# EAGLE schematic PolIrkutska_DOZATOR_el (EAGLE 7.0.0)
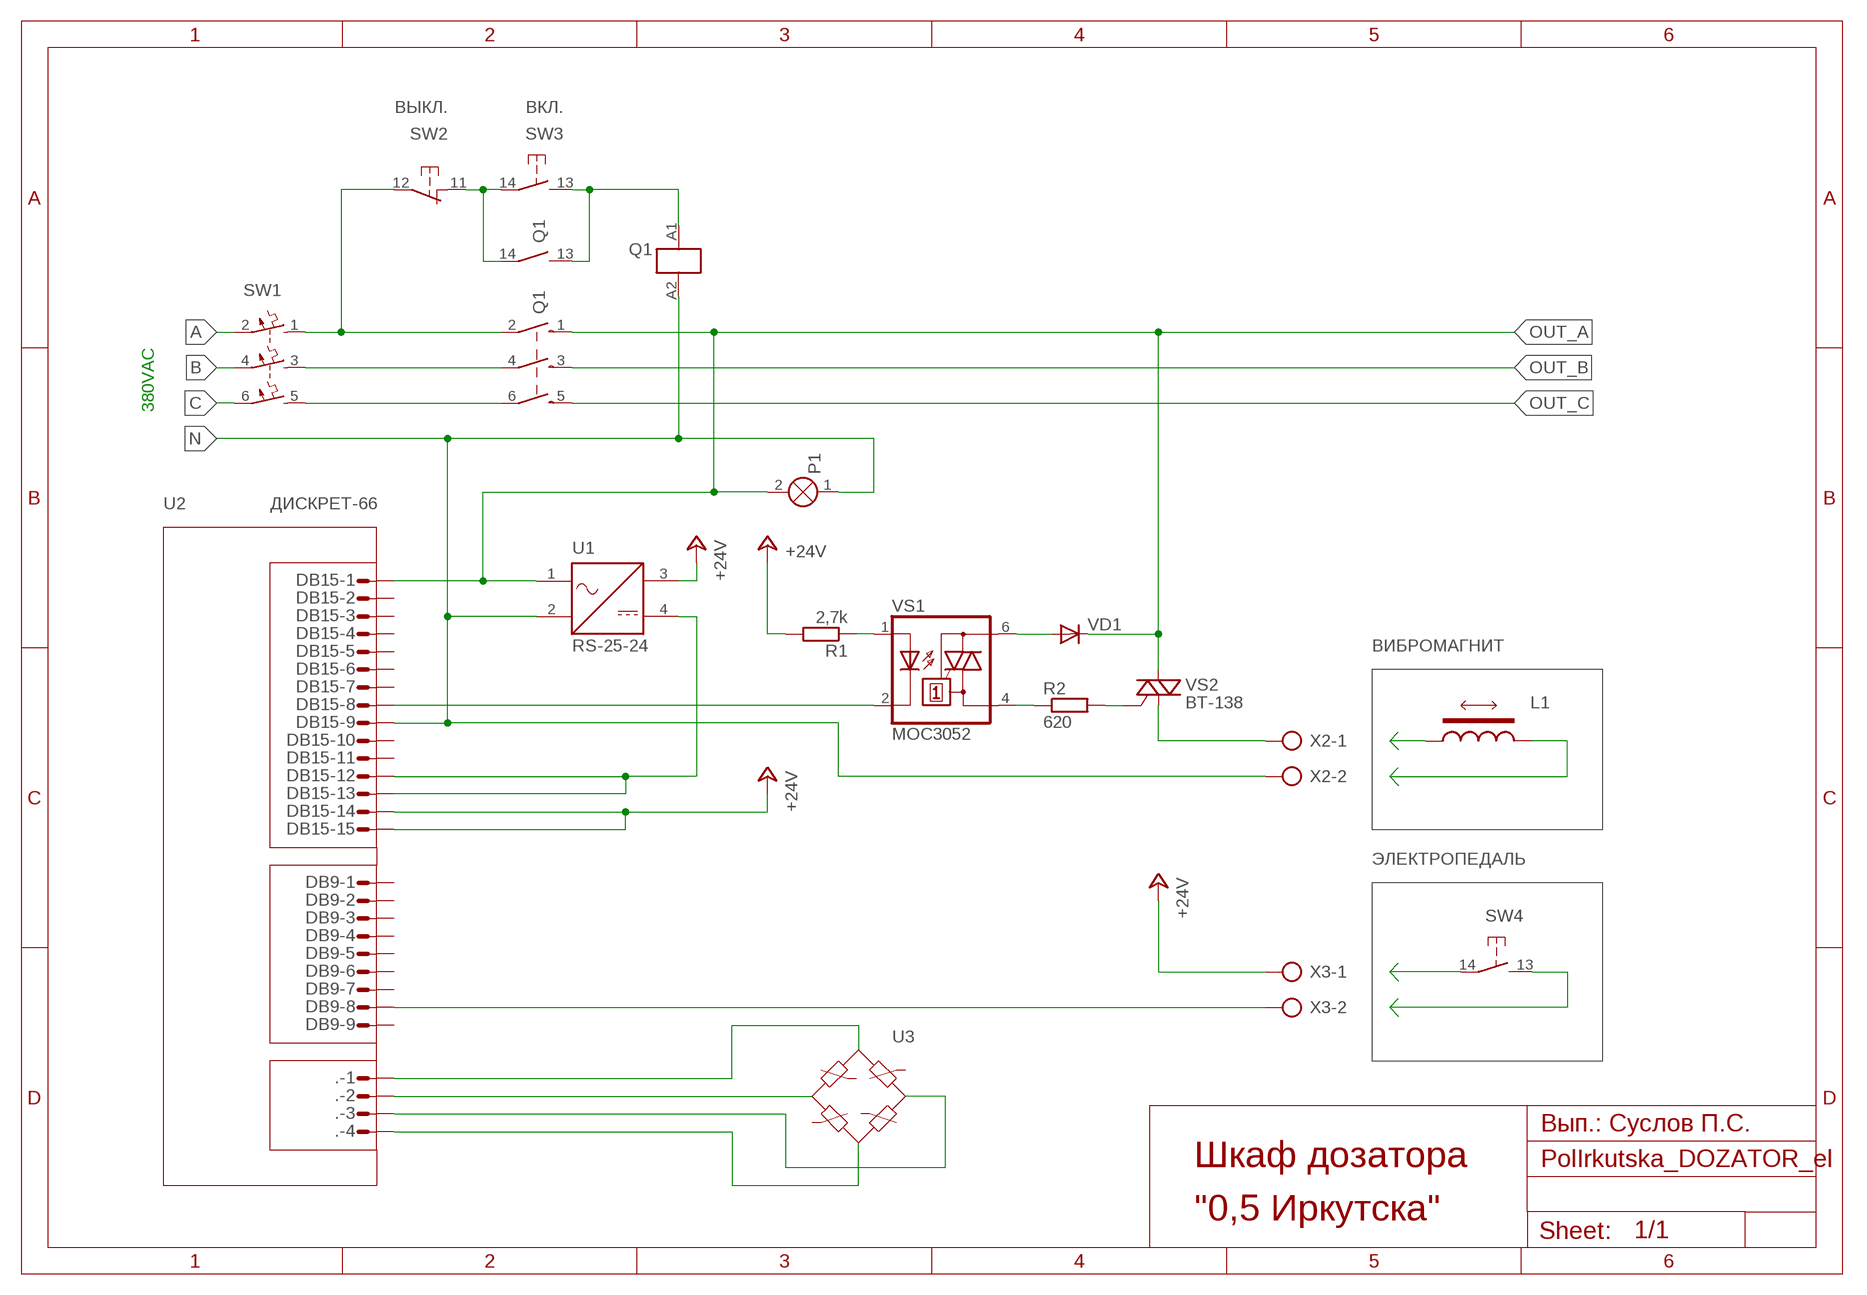
[diagram p0: schematic, sheet 1]

## Parts
.  L04P  [L04P]
DB9  L09P  [L09P]
DB15  L15P  [L15P]
L1  L-US0204/5  [0204/5]
P1  SIGNALLAMPE  [LAMPE]
Q1  HAUPTSCHUETZ_3-POL_HILFSKONTAKT_13-14  [HAUPTSCHUETZ_3-POL+HILFSKONTAKT_13-14]
R1  2,7k  R-EU_0204/2V  [0204V]
R2  620  R-EU_0204/2V  [0204V]
SW1  LEITUNGSSCHUTZSCHALTER_3-POL  [LEITUNGSSCHUTZSCHALTER_3-POL]
SW2  ВЫКЛ.  OEFFNER_TASTSCHALTER  [OEFFNER_TASTSCHALTER]
SW3  ВКЛ.  SCHLIESSER_TASTSCHALTER  [SCHLIESSER_TASTSCHALTER]
SW4  SCHLIESSER_TASTSCHALTER  [SCHLIESSER_TASTSCHALTER]
U1  RS-25-24  NETZTEIL_GLEICHSPANNUNG  [NETZTEIL_GLEICHSPANNUNG]
VD1  1N4148DO35-7  [DO35-7]
VS1  MOC3052  MOC3042T  [DIL06B]
VS2  BT-138  TRIAC  [TRIAC]
X2  AK500/2  [AK500/2]
X3  AK500/2  [AK500/2]

## Nets
+24V: DB15.14 DB15.15 R1.2 U1.3 X3.1
A: SW1.2
B: SW1.4
C: SW1.6
N: DB15.9 P1.1(X1) Q1.A2(1:A2) U1.2 X2.2
N$2: VS2.A2 X2.1
N$3: R2.1 VS1.4(A1)
N$4: Q1.6 SW1.5
N$5: Q1.13 Q1.A1(1:A1) SW3.13
N$6: Q1.14 SW2.11 SW3.14
N$7: Q1.4 SW1.3
N$8: R2.2 VS2.G
N$9: VD1.A VS1.6(A2)
N$10: Q1.2 SW1.1 SW2.12
N$11: R1.1 VS1.1(A)
N$12: DB15.8 VS1.2(C)
N$13: DB9.8 X3.2
N$15: DB15.12 DB15.13 U1.4
N$16: ..1
N$17: ..2
N$18: ..3
N$19: ..4
N$20: L1.1
N$21: L1.2
N$22: SW4.14
N$23: SW4.13
OUT_A: DB15.1 P1.2(X2) Q1.1 U1.1 VD1.C VS2.A1
OUT_B: Q1.3
OUT_C: Q1.5
Unconnected: DB9.1 DB9.2 DB9.3 DB9.4 DB9.5 DB9.6 DB9.7 DB9.9 DB15.2 DB15.3 DB15.4 DB15.5 DB15.6 DB15.7 DB15.10 DB15.11

## Notes on the sheet
- 380VAC
- U2 | ДИСКРЕТ-66
- ВИБРОМАГНИТ
- ЭЛЕКТРОПЕДАЛЬ
- U3
- Вып.: Суслов П.С.
- Шкаф дозатора
- "0,5 Иркутска"

## Library data of the parts
. = con-amp-mt:L04P: AMP MT CONNECTOR; OC_FARNELL: unknown; OC_NEWARK: unknown
DB9 = con-amp-mt:L09P: AMP MT CONNECTOR; OC_FARNELL: unknown; OC_NEWARK: unknown
DB15 = con-amp-mt:L15P: AMP MT CONNECTOR; OC_FARNELL: unknown; OC_NEWARK: unknown
L1 = rcl:L-US: INDUCTOR, American symbol
P1 = e-lampen-signalisation:SIGNALLAMPE: Lampe
Q1 = e-schuetze-relais:HAUPTSCHUETZ_3-POL_HILFSKONTAKT_13-14: Hauptschütz 3-pol. mit Hilfskontakt-Schließer
R1 R2 = rcl:R-EU_: RESISTOR, European symbol
SW1 = e-sicherungen:LEITUNGSSCHUTZSCHALTER_3-POL: Leitungsschutzschalter, 3-pol.
SW2 = e-schalter:OEFFNER_TASTSCHALTER: Tastschalter, Öffner
SW3 SW4 = e-schalter:SCHLIESSER_TASTSCHALTER: Tastschalter, Schließer
U1 = e-stromversorgungselemente:NETZTEIL_GLEICHSPANNUNG: Netzteil, Gleichspannung
VD1 = diode:1N4148: DIODE high speed (Philips)
VS1 = optocoupler:MOC30*: 6-Pin DIP Zero-Cross Optoisolators Triac Driver Output (250/400 Volt Peak) Source: Data sheet <http://www.fairchildsemi.com/ds/MO/MOC3031M.pdf> The old path of data sheet not more available 2013-05-06.; OC_FARNELL: unknown; OC_NEWARK: unknown
VS2 = e-halbleiter:TRIAC: Triac
X2 X3 = con-ptr500:AK500/2: CONNECTOR; OC_FARNELL: unknown; OC_NEWARK: unknown